# Altium schematic sheet QDRII_power.SchDoc: QDRII_power
size A4; Date: 18/06/2014; DrawnBy: J. Gabriel R.E.; Organization: Seven Solutions S.L.; Address1: C/Baza, Parcela 19, Nave 3; Address2: Polígono Ind. Juncaril; Address3: 18210-Peligros-Granada; Address4: Spain; Revision: 3.4; SheetNumber: 21; SheetTotal: 23; WebAddress: www.sevensols.com; Project: White Rabbit; ProjectName: White Rabbit
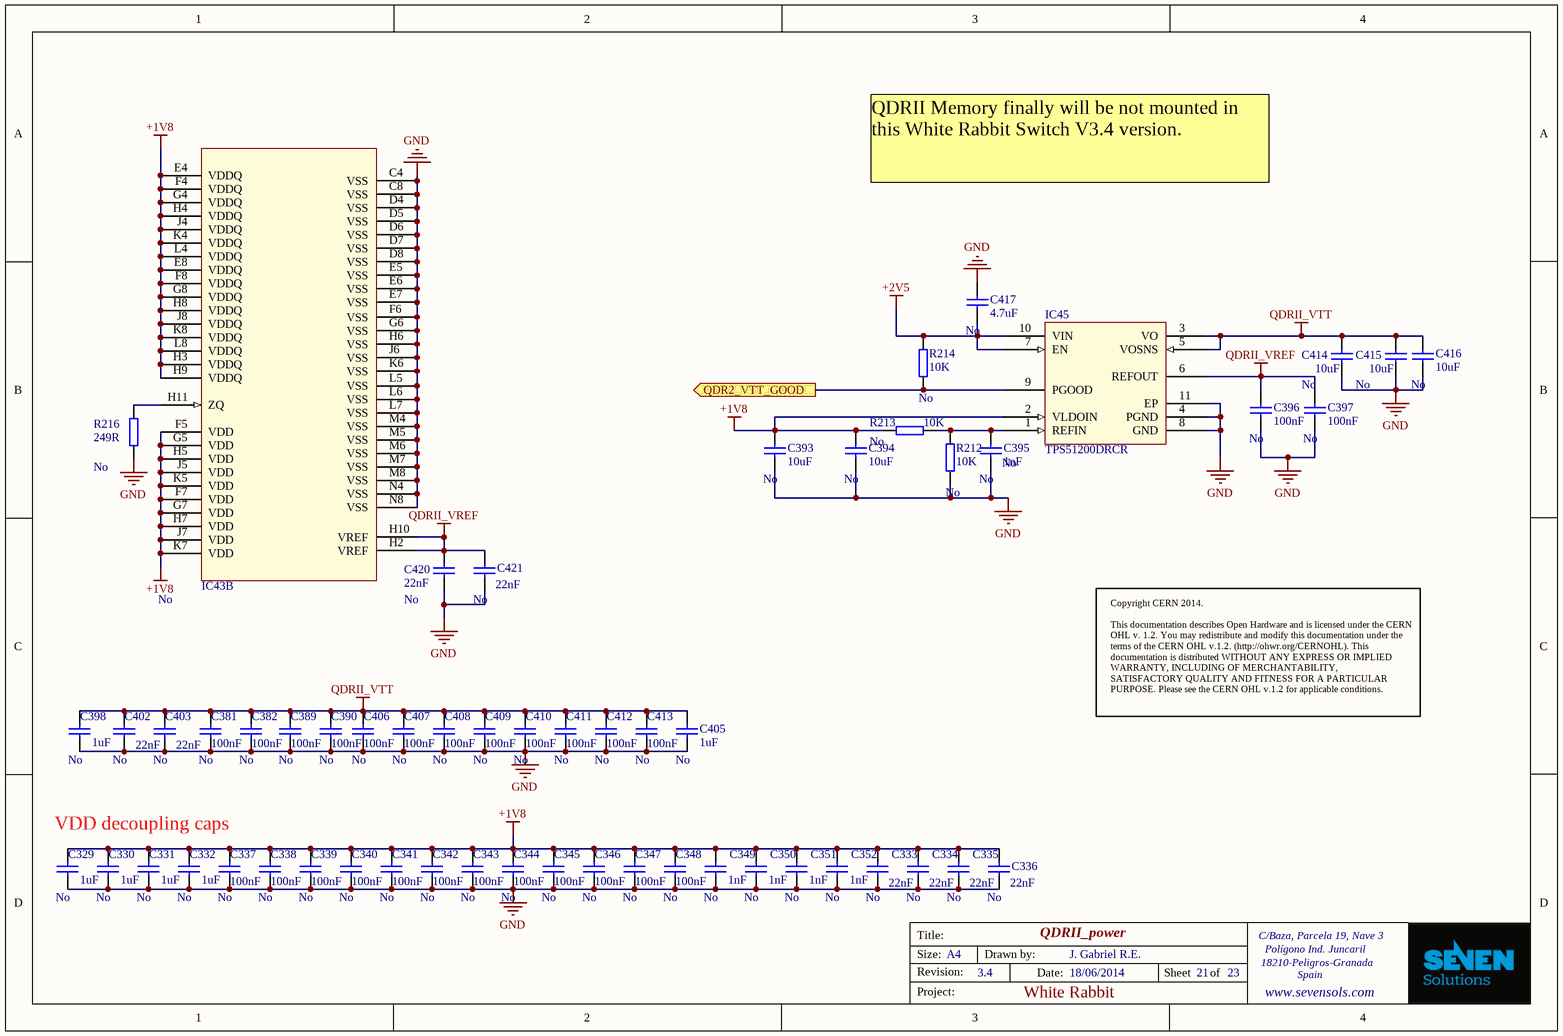
[diagram p0: QDRII_power.SchDoc]

## Parts
C329  Mounted: No  [CC1005-0402]  (hidden comment: 1uF)
C330  Mounted: No  [CC1005-0402]  (hidden comment: 1uF)
C331  Mounted: No  [CC1005-0402]  (hidden comment: 1uF)
C332  Mounted: No  [CC1005-0402]  (hidden comment: 1uF)
C333  Mounted: No  [CC1005-0402]  (hidden comment: 22nF)
C334  Mounted: No  [CC1005-0402]  (hidden comment: 22nF)
C335  Mounted: No  [CC1005-0402]  (hidden comment: 22nF)
C336  Mounted: No  [CC1005-0402]  (hidden comment: 22nF)
C337  Mounted: No  [CC1005-0402]  (hidden comment: 100nF)
C338  Mounted: No  [CC1005-0402]  (hidden comment: 100nF)
C339  Mounted: No  [CC1005-0402]  (hidden comment: 100nF)
C340  Mounted: No  [CC1005-0402]  (hidden comment: 100nF)
C341  Mounted: No  [CC1005-0402]  (hidden comment: 100nF)
C342  Mounted: No  [CC1005-0402]  (hidden comment: 100nF)
C343  Mounted: No  [CC1005-0402]  (hidden comment: 100nF)
C344  Mounted: No  [CC1005-0402]  (hidden comment: 100nF)
C345  Mounted: No  [CC1005-0402]  (hidden comment: 100nF)
C346  Mounted: No  [CC1005-0402]  (hidden comment: 100nF)
C347  Mounted: No  [CC1005-0402]  (hidden comment: 100nF)
C348  Mounted: No  [CC1005-0402]  (hidden comment: 100nF)
C349  Mounted: No  [CC1005-0402]  (hidden comment: 1nF)
C350  Mounted: No  [CC1005-0402]  (hidden comment: 1nF)
C351  Mounted: No  [CC1005-0402]  (hidden comment: 1nF)
C352  Mounted: No  [CC1005-0402]  (hidden comment: 1nF)
C381  Mounted: No  [CC1005-0402]  (hidden comment: 100nF)
C382  Mounted: No  [CC1005-0402]  (hidden comment: 100nF)
C389  Mounted: No  [CC1005-0402]  (hidden comment: 100nF)
C390  Mounted: No  [CC1005-0402]  (hidden comment: 100nF)
C393  Mounted: No  [CC1608-0603]  (hidden comment: 10uF)
C394  Mounted: No  [CC1608-0603]  (hidden comment: 10uF)
C395  Mounted: No  [CC1005-0402]  (hidden comment: 1nF)
C396  Mounted: No  [CC1005-0402]  (hidden comment: 100nF)
C397  Mounted: No  [CC1005-0402]  (hidden comment: 100nF)
C398  Mounted: No  [CC1005-0402]  (hidden comment: 1uF)
C402  Mounted: No  [CC1005-0402]  (hidden comment: 22nF)
C403  Mounted: No  [CC1005-0402]  (hidden comment: 22nF)
C405  Mounted: No  [CC1005-0402]  (hidden comment: 1uF)
C406  Mounted: No  [CC1005-0402]  (hidden comment: 100nF)
C407  Mounted: No  [CC1005-0402]  (hidden comment: 100nF)
C408  Mounted: No  [CC1005-0402]  (hidden comment: 100nF)
C409  Mounted: No  [CC1005-0402]  (hidden comment: 100nF)
C410  Mounted: No  [CC1005-0402]  (hidden comment: 100nF)
C411  Mounted: No  [CC1005-0402]  (hidden comment: 100nF)
C412  Mounted: No  [CC1005-0402]  (hidden comment: 100nF)
C413  Mounted: No  [CC1005-0402]  (hidden comment: 100nF)
C414  Mounted: No  [CC1608-0603]  (hidden comment: 10uF)
C415  Mounted: No  [CC1608-0603]  (hidden comment: 10uF)
C416  Mounted: No  [CC1608-0603]  (hidden comment: 10uF)
C417  Mounted: No  [CC1608-0603]  (hidden comment: 4.7uF)
C420  Mounted: No  [CC1005-0402]  (hidden comment: 22nF)
C421  Mounted: No  [CC1005-0402]  (hidden comment: 22nF)
IC43  Mounted: No  [BGA165C100P11X15_1300X1500X140]  (hidden comment: CY7C1314KV18-250BZC)  (part B of 2)
IC45  TPS51200DRCR  Mounted: No  [SON50P300X300X100-11N-R175X250]
R212  Mounted: No  [0402]  (hidden comment: 10k)
R213  Mounted: No  [0402]  (hidden comment: 10k)
R214  Mounted: No  [0402]  (hidden comment: 10k)
R216  Mounted: No  [0402]  (hidden comment: 249R)

## Ports
QDR2_VTT_GOOD (out)

## Nets
+1V8: C329.2 C330.2 C331.2 C332.2 C333.2 C334.2 C335.2 C336.2 C337.1 C338.1 C339.1 C340.1 C341.1 C342.1 C343.1 C344.1 C345.1 C346.1 C347.1 C348.1 C349.2 C350.2 C351.2 C352.2 C393.2 C394.2 IC43.E4(VDDQ) IC43.E8(VDDQ) IC43.F4(VDDQ) IC43.F5(VDD) IC43.F7(VDD) IC43.F8(VDDQ) IC43.G4(VDDQ) IC43.G5(VDD) IC43.G7(VDD) IC43.G8(VDDQ) IC43.H3(VDDQ) IC43.H4(VDDQ) IC43.H5(VDD) IC43.H7(VDD) IC43.H8(VDDQ) IC43.H9(VDDQ) IC43.J4(VDDQ) IC43.J5(VDD) IC43.J7(VDD) IC43.J8(VDDQ) IC43.K4(VDDQ) IC43.K5(VDD) IC43.K7(VDD) IC43.K8(VDDQ) IC43.L4(VDDQ) IC43.L8(VDDQ) IC45.2(VLDOIN) R213.2
+2V5: C417.1 IC45.7(EN) IC45.10(VIN) R214.2
GND: C329.1 C330.1 C331.1 C332.1 C333.1 C334.1 C335.1 C336.1 C337.2 C338.2 C339.2 C340.2 C341.2 C342.2 C343.2 C344.2 C345.2 C346.2 C347.2 C348.2 C349.1 C350.1 C351.1 C352.1 C381.2 C382.2 C389.2 C390.2 C393.1 C394.1 C395.1 C396.2 C397.2 C398.1 C402.1 C403.1 C405.1 C406.2 C407.2 C408.2 C409.2 C410.2 C411.2 C412.2 C413.2 C414.1 C415.1 C416.1 C417.2 C420.1 C421.1 IC43.C4(VSS) IC43.C8(VSS) IC43.D4(VSS) IC43.D5(VSS) IC43.D6(VSS) IC43.D7(VSS) IC43.D8(VSS) IC43.E5(VSS) IC43.E6(VSS) IC43.E7(VSS) IC43.F6(VSS) IC43.G6(VSS) IC43.H6(VSS) IC43.J6(VSS) IC43.K6(VSS) IC43.L5(VSS) IC43.L6(VSS) IC43.L7(VSS) IC43.M4(VSS) IC43.M5(VSS) IC43.M6(VSS) IC43.M7(VSS) IC43.M8(VSS) IC43.N4(VSS) IC43.N8(VSS) IC45.4(PGND) IC45.8(GND) IC45.11(EP) R212.1 R216.1
QDRII_VREF: C396.1 C397.1 C420.2 C421.2 IC43.H2(VREF) IC43.H10(VREF) IC45.6(REFOUT)
QDRII_VTT: C381.1 C382.1 C389.1 C390.1 C398.2 C402.2 C403.2 C405.2 C406.1 C407.1 C408.1 C409.1 C410.1 C411.1 C412.1 C413.1 C414.2 C415.2 C416.2 IC45.3(VO) IC45.5(VOSNS)
QDR2_VTT_GOOD: IC45.9(PGOOD) R214.1 ; port QDR2_VTT_GOOD
NetC395_2: C395.2 IC45.1(REFIN) R212.2 R213.1
NetIC43_H11: IC43.H11(ZQ) R216.2

## Notes on the sheet
- QDRII Memory finally will be not mounted in this White Rabbit Switch V3.4 version.
- Copyright CERN 2014.
  This documentation describes Open Hardware and is licensed under the CERN OHL v. 1.2. You may redistribute and modify this documentation under the terms of the CERN OHL v.1.2. (http://ohwr.org/CERNOHL). This documentation is distributed WITHOUT ANY EXPRESS OR IMPLIED WARRANTY, INCLUDING OF MERCHANTABILITY, SATISFACTORY QUALITY AND FITNESS FOR A PARTICULAR PURPOSE. Please see the CERN OHL v.1.2 for applicable conditions.
- VDD decoupling caps
- Title:
- Size:
- Revision:
- A4
- Drawn by:
- Date:
- Sheet
- of
- Project:

## Library data of the parts
C329-C332 C398 C405 = CC0402_1UF_16V_10%_X5R: Capacitor; Manufacturer1: TDK; Manufacturer1 PN: C1005X5R1C105K; TC: X5R; Tolerance: ±10%; Voltage: 16V; Published: 8-Jun-2000; LatestRevisionDate: 17-Jul-2002; LatestRevisionNote: Re-released for DXP Platform.; PackageReference: RAD-0.3; Publisher: Altium Limited; Distributor1: Digikey; Distributor1 PN: 445-4978-1-ND; Case: 0402; Value: 1uF
C333-C336 C402 C403 C420 C421 = CC0402_22NF_25V_10%_X7R: Capacitor; Manufacturer1: TDK; Manufacturer1 PN: C1005X7R1E223K; TC: X7R; Tolerance: ±10%; Voltage: 25V; Published: 8-Jun-2000; LatestRevisionDate: 17-Jul-2002; LatestRevisionNote: Re-released for DXP Platform.; PackageReference: RAD-0.3; Publisher: Altium Limited; Distributor1: Digikey; Distributor1 PN: 445-1261-1-ND; Case: 0402; Value: 22nF
C337-C348 C381 C382 C389 C390 C396 C397 C406-C413 = CC0402_100NF_16V_10%_X7R: Capacitor; Manufacturer1: TDK; Manufacturer1 PN: C1005X7R1C104K; TC: X7R; Tolerance: ±10%; Voltage: 16V; Published: 8-Jun-2000; LatestRevisionDate: 17-Jul-2002; LatestRevisionNote: Re-released for DXP Platform.; PackageReference: RAD-0.3; Publisher: Altium Limited; Distributor1: Digikey; Distributor1 PN: 445-4952-1-ND; Case: 0402; Value: 100nF
C349-C352 C395 = CC0402_1NF_25V_10%_X7R: Capacitor; Manufacturer1: TDK; Manufacturer1 PN: C1005X7R1E102K; TC: X7R; Tolerance: ±10%; Voltage: 25V; Published: 8-Jun-2000; LatestRevisionDate: 17-Jul-2002; LatestRevisionNote: Re-released for DXP Platform.; PackageReference: RAD-0.3; Publisher: Altium Limited; Distributor1: Digikey; Distributor1 PN: 445-4924-1-ND; Case: 0402; Value: 1nF
C393 C394 C414-C416 = CC0603_10UF_6.3V_20%_X5R: Capacitor; Manufacturer1: TDK; Manufacturer1 PN: C1608X5R0J106M; TC: X5R; Tolerance: ±20%; Voltage: 6.3V; Published: 8-Jun-2000; LatestRevisionDate: 17-Jul-2002; LatestRevisionNote: Re-released for DXP Platform.; PackageReference: RAD-0.3; Publisher: Altium Limited; Distributor1: Digikey; Distributor1 PN: 445-4112-1-ND; Case: 0603; Value: 10uF
C417 = CC0603_4.7UF_10V_10%_X5R: Capacitor; Manufacturer1: TDK; Manufacturer1 PN: C1608X5R1A475K; TC: X5R; Tolerance: ±10%; Voltage: 10V; Published: 8-Jun-2000; LatestRevisionDate: 17-Jul-2002; LatestRevisionNote: Re-released for DXP Platform.; PackageReference: RAD-0.3; Publisher: Altium Limited; Distributor1: Digikey; Distributor1 PN: 445-5170-1-ND; Case: 0603; Value: 4.7uF
IC43 = CY7C1314CV18: 18-Mbit (512Kx36) QDRII SRAM 2-Word Burst Architecture; Value: CY7C1314KV18-250BZC; Distributor1 PN: CY7C1314KV18-250BZC -ND; Distributor1: Digikey
IC45 = TPS51200: Sink/Source DDR Termination Regulator; Value: TPS51200DRCR; Distributor1 PN: 296-26978-1-ND; Distributor1: Digikey
R212-R214 = R0402_10K_±1%_0.1W_100PPM: SMD Resistor; Manufacturer1: Panasonic; Manufacturer1 PN: ERJ-2RKF1002X; TCR: 100ppm; Power Rating: 0.1W; Tolerance: ±1%; Case: 0402; Distributor1: DigiKey; Distributor1 PN: P10.0KLCT-ND; Value: 10K
R216 = R0402_249R_±1%_0.1W_100PPM: SMD Resistor; Manufacturer1: Panasonic; Manufacturer1 PN: ERJ-2RKF2490X; TCR: 100ppm; Power Rating: 0.1W; Tolerance: ±1%; Case: 0402; Distributor1: DigiKey; Distributor1 PN: P249LCT-ND; Value: 249R